# Altium schematic sheet Sheet1.SchDoc
size A4; SheetNumber: 1; SheetTotal: 1
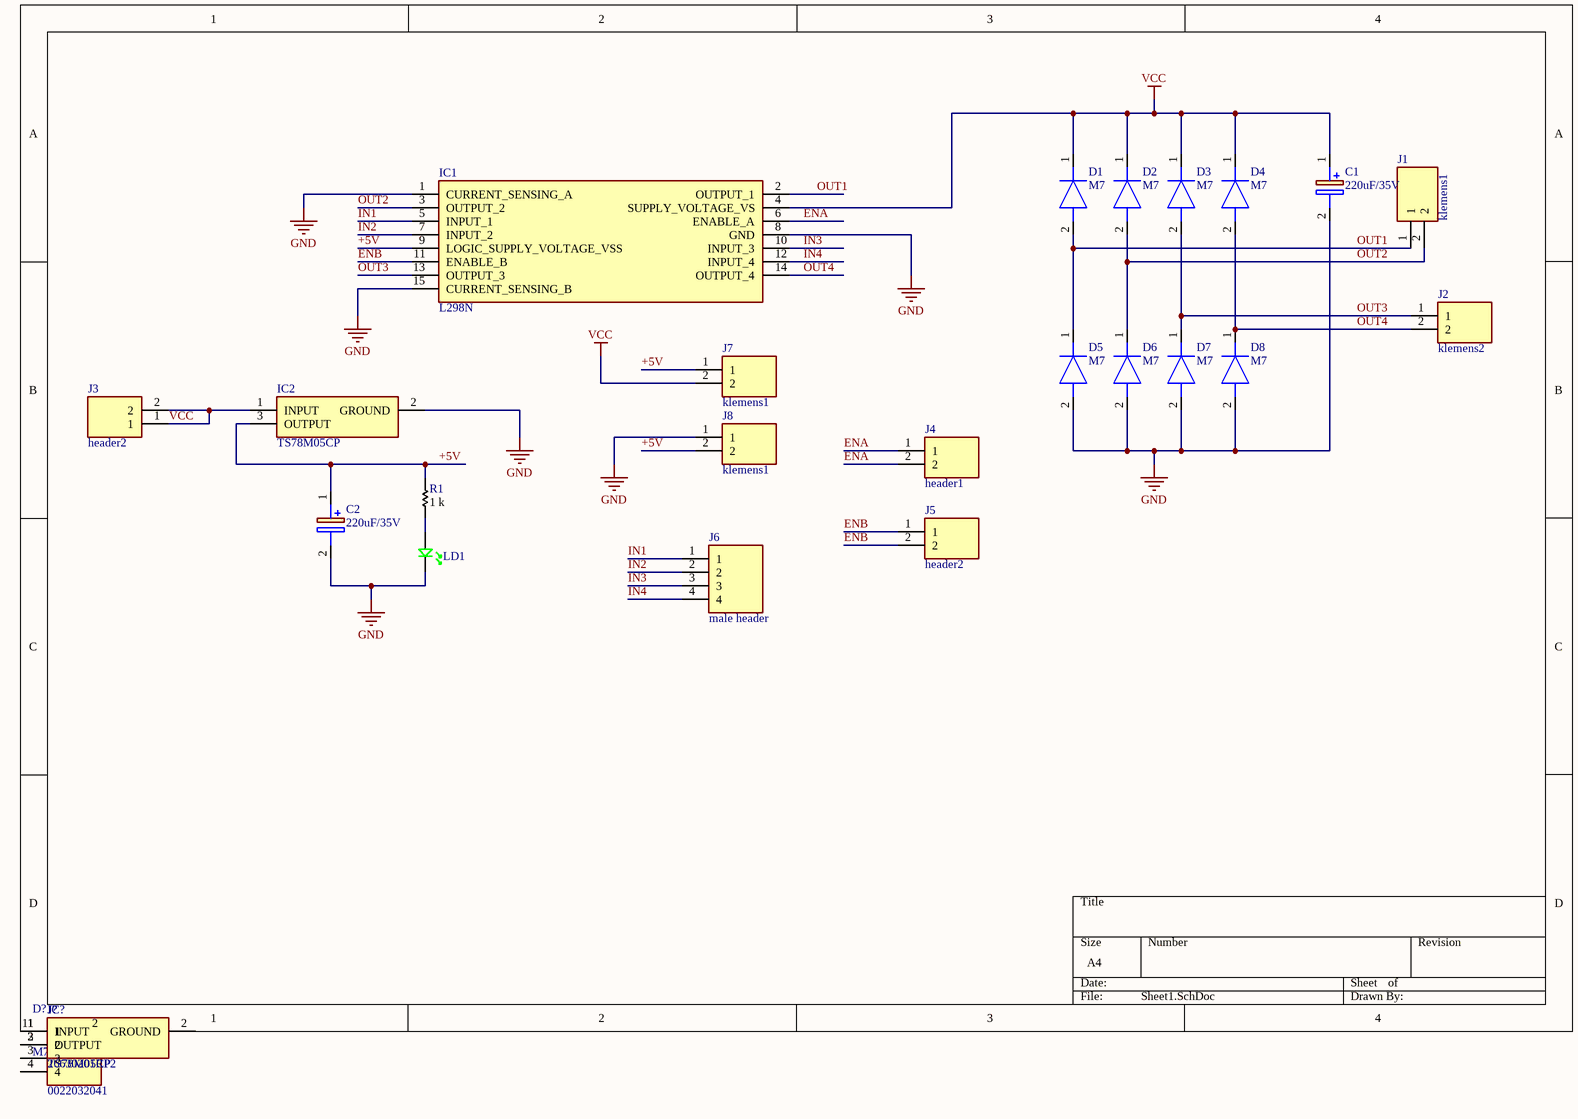
[diagram p0: Sheet1.SchDoc]

## Parts
(Parts that share a designator on the sheet are numbered #1, #2 ... from top to bottom, then left to right.)
C1  220uF/35V  [CAPAE530X550N]
C2  220uF/35V  [CAPAE530X550N]
D1  M7  [DIOM5626X245N]
D2  M7  [DIOM5626X245N]
D3  M7  [DIOM5626X245N]
D4  M7  [DIOM5626X245N]
D5  M7  [DIOM5626X245N]
D6  M7  [DIOM5626X245N]
D7  M7  [DIOM5626X245N]
D8  M7  [DIOM5626X245N]
D?  M7  [DIOM5626X245N]
IC1  L298N  [MULTIWATT15V_1]
IC2  TS78M05CP  [TS78M05CP]
IC?  TS78M05CP  [TS78M05CP]
J1  klemens1  [0393800102]
J2  klemens2  [0393800102]
J3  header2  [HDRV2W51P0X201_1X2_500X201X556P]
J4  header1  [HDRV2W51P0X201_1X2_500X201X556P]
J5  header2  [HDRV2W51P0X201_1X2_500X201X556P]
J6  male header  [HDRV4W87P0X254_1X4_991X236X1155P]
J7  klemens1  [0393800102]
J8  klemens1  [0393800102]
J?#1  0022032041  [HDRV4W87P0X254_1X4_991X236X1155P]
J?#2  26630201RP2  [HDRV2W51P0X201_1X2_500X201X556P]
LD1  LTST-C170KGKT  [LITEON_0805-GREEN]  (value not drawn)
R1  Resistance: 1 k  [ROYALOHM_RES_0603]  (hidden comment: 0603SAJ0102T5E)

## Nets
GND: C1.2(-) C2.2(-) D5.2(A) D6.2(A) D7.2(A) D8.2(A) IC1.1(CURRENT_SENSING_A) IC1.8(GND) IC1.15(CURRENT_SENSING_B) IC2.2(GROUND) J8.1 LD1.2(R-)
VCC: C1.1(+) D1.1(K) D2.1(K) D3.1(K) D4.1(K) IC1.4(SUPPLY_VOLTAGE_VS) IC2.1(INPUT) J3.1 J3.2 J7.2
+5V: C2.1(+) IC1.9(LOGIC_SUPPLY_VOLTAGE_VSS) IC2.3(OUTPUT) J7.1 J8.2 R1.2
ENA: IC1.6(ENABLE_A) J4.1 J4.2
ENB: IC1.11(ENABLE_B) J5.1 J5.2
IN1: IC1.5(INPUT_1) J6.1
IN2: IC1.7(INPUT_2) J6.2
IN3: IC1.10(INPUT_3) J6.3
IN4: IC1.12(INPUT_4) J6.4
OUT1: D1.2(A) D5.1(K) IC1.2(OUTPUT_1) J1.1
OUT2: D2.2(A) D6.1(K) IC1.3(OUTPUT_2) J1.2
OUT3: D3.2(A) D7.1(K) IC1.13(OUTPUT_3) J2.1
OUT4: D4.2(A) D8.1(K) IC1.14(OUTPUT_4) J2.2
NetD?_1: D?.1(K) IC?.1(INPUT) J?#1.1 J?#2.1
NetIC?_3: IC?.3(OUTPUT) J?#1.2 J?#2.2
NetLD1_1: LD1.1(R+) R1.1

Not connected (* = marked no-connect by the designer): D? 2(A); IC? 2(GROUND); J?#1 3 4

## Library data of the parts
C1 C2 = UWX0J470MCL1GB: Capacitor Polarised; Manufacturer_Name: Nichicon; Datasheet Link: https://componentsearchengine.com/Datasheets/2/UWX0J470MCL1GB.pdf; Height: 5.5mm; Manufacturer_Part_Number: UWX0J470MCL1GB; Mouser Part Number: 647-UWX0J470MCL1; Mouser Price/Stock: https://www.mouser.co.uk/ProductDetail/Nichicon/UWX0J470MCL1GB?qs=e8oIoAS2J1Ro712%252BE6r%252Bfg%3D%3D; Arrow Part Number: UWX0J470MCL1GB; Arrow Price/Stock: https://www.arrow.com/en/products/uwx0j470mcl1gb/nichicon?region=nac
D1-D8 D? = M7: Diode; Manufacturer_Name: LGE; Datasheet Link: https://datasheet.lcsc.com/szlcsc/LGE-M7-SMAJ_C330214.pdf; Height: 2.45mm; Manufacturer_Part_Number: M7
IC1 = L298N: Integrated Circuit; Manufacturer_Name: Magnatec; Manufacturer_Part_Number: L298N
IC2 IC? = TS78M05CP: Integrated Circuit; Manufacturer_Name: Taiwan Semiconductor; Datasheet Link: https://componentsearchengine.com/Datasheets/1/TS78M05CP.pdf; Height: 2.38mm; Manufacturer_Part_Number: TS78M05CP; Mouser Part Number: 821-TS78M05CP; Mouser Price/Stock: https://www.mouser.co.uk/ProductDetail/Taiwan-Semiconductor/TS78M05CP?qs=F0bBuU9YDEzJZsmmDzcbEA%3D%3D
J1 J2 J7 J8 = 0393800102: Connector; Manufacturer_Name: Molex; Datasheet Link: https://www.molex.com/pdm_docs/sd/393800102_sd.pdf; Height: 21.63mm; Manufacturer_Part_Number: 0393800102; Mouser Part Number: N/A; Mouser Price/Stock: https://www.mouser.co.uk/ProductDetail/Molex/0393800102?qs=PBcRNPEHKspywEvg9%2FvnAw%3D%3D; Arrow Part Number: 0393800102; Arrow Price/Stock: https://www.arrow.com/en/products/0393800102/molex
J3-J5 J?#2 = 26630201RP2: Connector; Manufacturer_Name: NorComp; Datasheet Link: https://datasheet.datasheetarchive.com/originals/dk/DKDS-31/606291.pdf; Height: 5.563mm; Manufacturer_Part_Number: 26630201RP2; Mouser Part Number: 636-26630201RP2; Mouser Price/Stock: https://www.mouser.co.uk/ProductDetail/NorComp/26630201RP2?qs=TaIhzdgpGpXrxdLS9EY2Xg%3D%3D
J6 J?#1 = 0022032041: Connector; Manufacturer_Name: Molex; Datasheet Link: http://www.molex.com/pdm_docs/sd/022032041_sd.pdf; Height: 11.55mm; Manufacturer_Part_Number: 0022032041; Mouser Part Number: N/A; Mouser Price/Stock: https://www.mouser.co.uk/ProductDetail/Molex/0022032041?qs=PBcRNPEHKsrt5pJfEqGMHQ%3D%3D; Arrow Part Number: 0022032041; Arrow Price/Stock: https://www.arrow.com/en/products/0022032041/molex?region=europe
LD1 = LTST-C170KGKT: LED GREEN CLEAR SMD; Supplier 1: Digi-Key; Supplier 2: Mouser; Supplier Part Number 1: 160-1414-1-ND; Supplier Part Number 2: 859-LTST-C170KGKT
R1 = 0603SAJ0102T5E: RES SMD 1K OHM 5% 1/10W 0603